# EAGLE design SparkFun_Air_Quality_ENS160 (EAGLE 9.6.2)
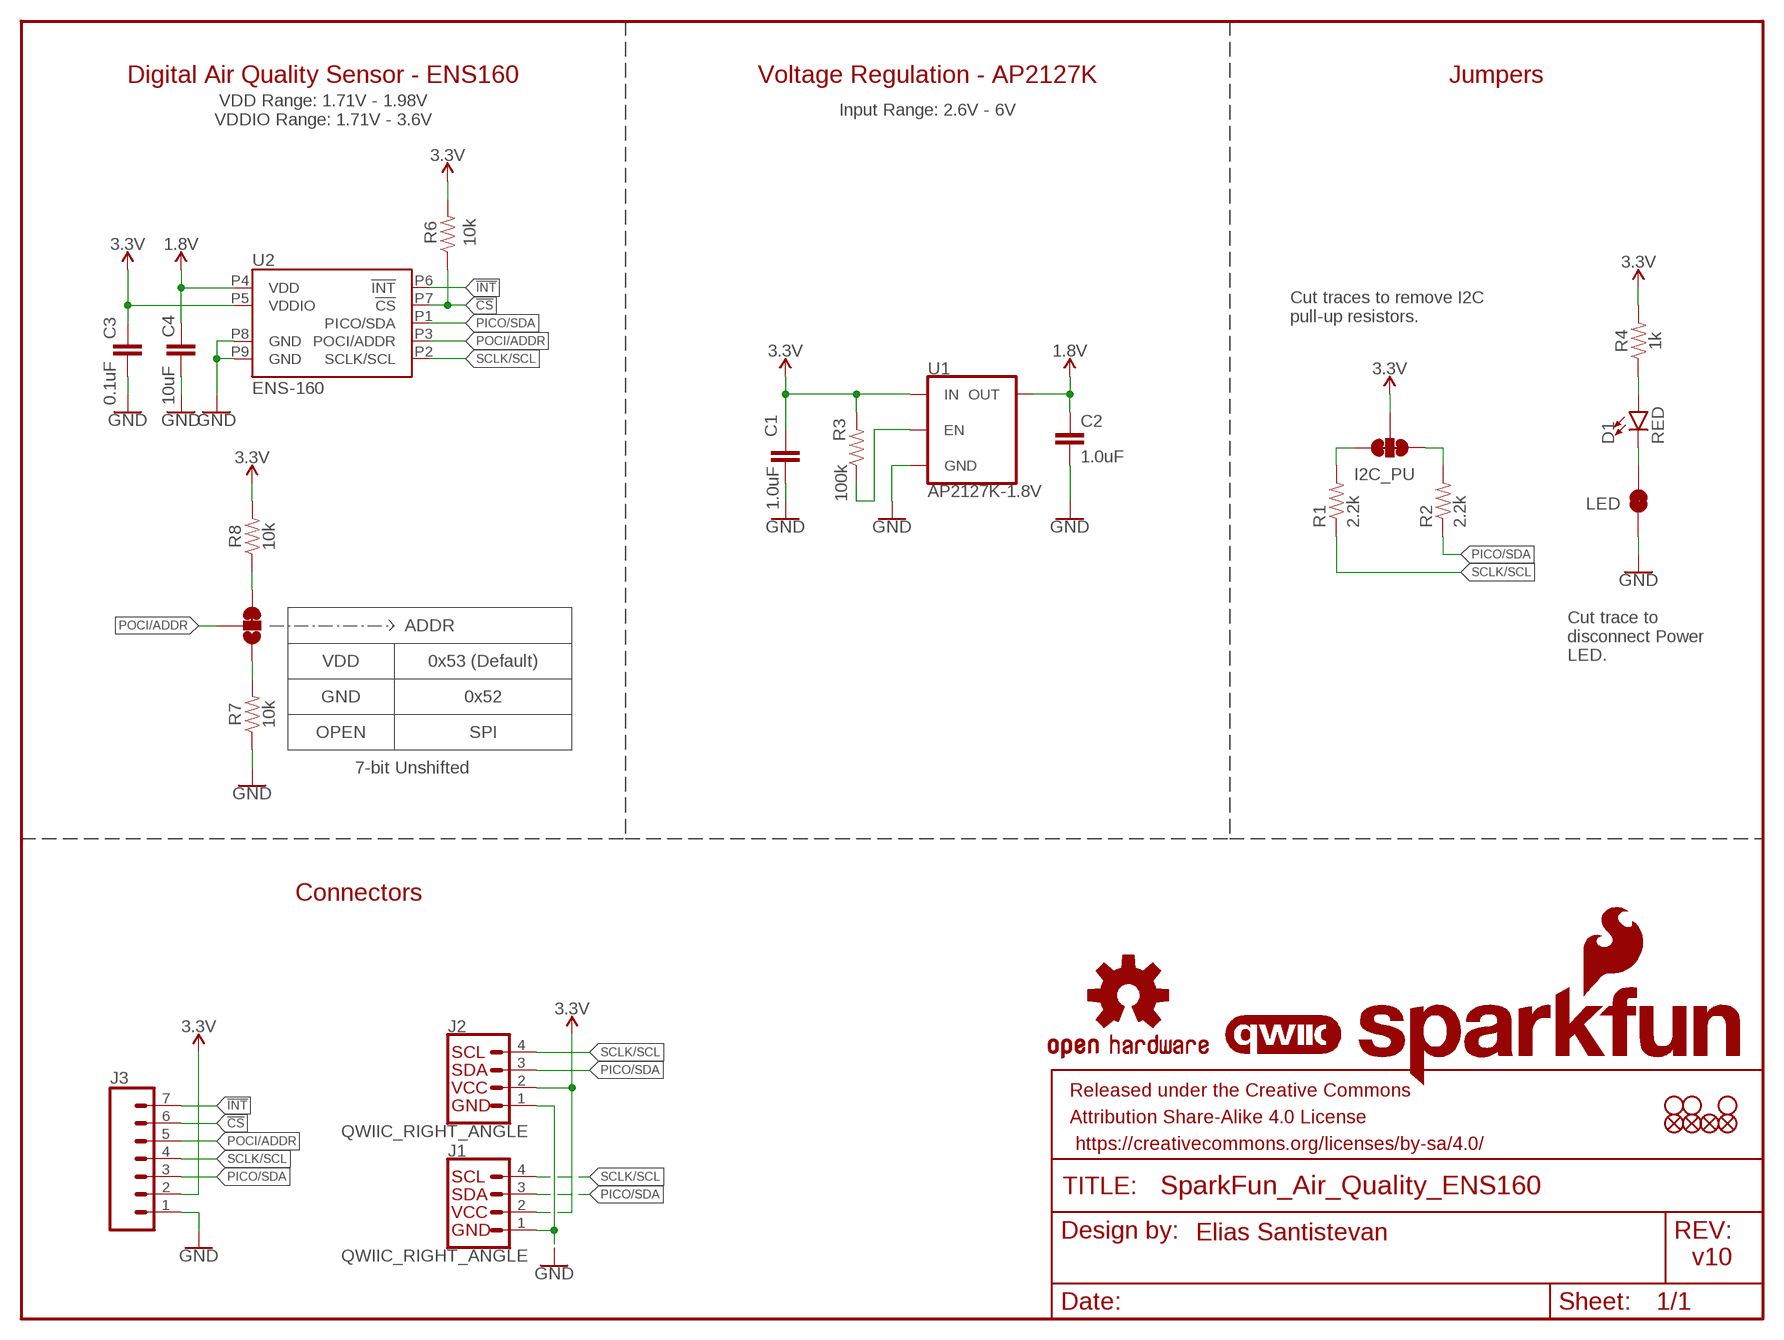
[diagram p0: schematic, sheet 1]

## Parts
ADDR  JUMPER-SMT_3_1-NC_TRACE_SILK  [SMT-JUMPER_3_1-NC_TRACE_SILK]
C1  1.0uF  1.0UF-0603-16V-10%  [0603]
C2  1.0uF  1.0UF-0603-16V-10%  [0603]
C3  0.1uF  0.1UF-0603-25V-(+80/-20%)  [0603]
C4  10uF  10UF-0603-6.3V-20%  [0603]
D1  RED  LED-RED0603  [LED-0603]
FD1  FIDUCIAL1X2  [FIDUCIAL-1X2]
FD2  FIDUCIAL1X2  [FIDUCIAL-1X2]
FD3  FIDUCIAL1X2  [FIDUCIAL-1X2]
FD4  FIDUCIAL1X2  [FIDUCIAL-1X2]
FRAME1  FRAME-LETTER  [CREATIVE_COMMONS]
I2C_PU  S_MODE  JUMPER-SMT_3_2-NC_TRACE_SILK  [SMT-JUMPER_3_2-NC_TRACE_SILK]
J1  QWIIC_RIGHT_ANGLE  QWIIC_CONNECTORJS-1MM  [JST04_1MM_RA]
J2  QWIIC_RIGHT_ANGLE  QWIIC_CONNECTORJS-1MM  [JST04_1MM_RA]
J3  CONN_07NO_SILK  [1X07_NO_SILK]
LED  JUMPER-SMT_2_NC_TRACE_SILK  [SMT-JUMPER_2_NC_TRACE_SILK]
LOGO2  OSHW-LOGOMINI  [OSHW-LOGO-MINI]
LOGO3  SFE_LOGO_NAME_FLAME.1_INCH  [SFE_LOGO_NAME_FLAME_.1]
LOGO4  QWIIC_LOGO_4MM  [QWIIC_4MM]
R1  2.2k  2.2KOHM-0603-1/10W-1%  [0603]
R2  2.2k  2.2KOHM-0603-1/10W-1%  [0603]
R3  100k  100KOHM-0603-1/10W-1%  [0603]
R4  1k  1KOHM-0603-1/10W-1%  [0603]
R6  10k  10KOHM-0603-1/10W-1%  [0603]
R7  10k  10KOHM-0603-1/10W-1%  [0603]
R8  10k  10KOHM-0603-1/10W-1%  [0603]
STANDOFF1  STAND-OFFTIGHT  [STAND-OFF-TIGHT]
STANDOFF2  STAND-OFFTIGHT  [STAND-OFF-TIGHT]
STANDOFF5  STAND-OFFTIGHT  [STAND-OFF-TIGHT]
U1  AP2127K-1.8V  V_REG_AP2127K-1.8V  [SOT23-5]
U2  ENS-160  [LGA-9]

## Nets
1.8V: C2.1 C4.1 U1.5(OUT) U2.P4(VDD)
3.3V: C1.1 C3.1 I2C_PU.2 J1.2 J2.2 J3.2 R3.2 R4.2 R6.2 R8.2 U1.1(IN) U2.P5(VDDIO)
!CS!: J3.6 R6.1 U2.P7(!CS!)
!INT!: J3.7 U2.P6(!INT!)
GND: C1.2 C2.2 C3.2 C4.2 J1.1 J2.1 J3.1 LED.1 R7.1 U1.2(GND) U2.P8(GND) U2.P9(GND)
N$1: R3.1 U1.3(EN)
N$2: D1.A R4.1
N$3: D1.C LED.2
N$4: ADDR.3 R8.1
N$5: I2C_PU.1 R1.2
N$6: I2C_PU.3 R2.2
N$7: ADDR.1 R7.2
PICO/SDA: J1.3 J2.3 J3.3 R2.1 U2.P1(PICO/SDA)
POCI/ADDR: ADDR.2 J3.5 U2.P3(POCI/ADDR)
SCLK/SCL: J1.4 J2.4 J3.4 R1.1 U2.P2(SCLK/SCL)

## Notes on the sheet
- Digital Air Quality Sensor - ENS160 | Voltage Regulation - AP2127K | Jumpers
- VDD Range: 1.71V - 1.98V
  VDDIO Range: 1.71V - 3.6V
- Input Range: 2.6V - 6V
- Cut traces to remove I2C
  pull-up resistors.
- VDD | 0x53 (Default)
- Cut trace to
  disconnect Power
  LED.
- GND | 0x52
- OPEN | SPI
- 7-bit Unshifted
- Connectors
- Elias Santistevan
- v10

## Library data of the parts
ADDR = SparkFun-Jumpers:JUMPER-SMT_3_1-NC_TRACE: Normally closed trace jumper (1 of 2 connections) This jumper has a trace between two pads so it's normally closed (NC). The other connection is normally open (NO). Use a razor knife to open the connection. For best results follow the IPC guidelines for cutting traces: Cutout at least 0.063 mm (0.005 in). Remove all loose material to clean up the cut area. Seal the cut with an approved epoxy. Reapply solder to reclose the connection, or to close the NO connection.
C1 C2 = SparkFun-Capacitors:1.0UF: 1µF ceramic capacitors A capacitor is a passive two-terminal electrical component used to store electrical energy temporarily in an electric field.; PROD_ID: CAP-00868
C3 = SparkFun-Capacitors:0.1UF: 0.1µF ceramic capacitors A capacitor is a passive two-terminal electrical component used to store electrical energy temporarily in an electric field.; PROD_ID: CAP-00810
C4 = SparkFun-Capacitors:10UF: 10.0µF ceramic capacitors A capacitor is a passive two-terminal electrical component used to store electrical energy temporarily in an electric field.; PROD_ID: CAP-11015
D1 = SparkFun-LED:LED-RED: Red SMD LED Used in manufacturing of most products at SparkFun Packages: 0603 - SMD 0603 package [Product Link] <http://docs.avagotech.com/docs/AV02-0551EN> 0603 SMART - SMD 0603 SMART package ( more efficient and expensive)[Product Link] <http://www.osram-os.com/Graphics/XPic2/00077099_0.pdf> 1206 - SMD1206 package [Product Link] <https://www.sparkfun.com/datasheets/DevTools/LilyPad/Q150OVS4.pdff> SparkFun Products: Pro Mini 328 -5V <https://www.sparkfun.com/products/821> RedBoard <https://www.sparkfun.com/products/12757> IOIO-OTG <https://www.sparkfun.com/products/13613>; PROD_ID: DIO-00819
FD1-FD4 = SparkFun-Aesthetics:FIDUCIAL: Fiducial Alignment Points Point-of-reference for pick-and-place machines and other optical instruments.
FRAME1 = SparkFun-Aesthetics:FRAME-LETTER: Schematic Frame - Letter Standard 8.5x11 US Letter frame; DESIGNER: Elias Santistevan
I2C_PU = SparkFun-Jumpers:JUMPER-SMT_3_2-NC_TRACE: Normally closed trace jumper (2 of 2 connections) This jumper has a trace between all three pads so they are normally closed (NC). Use a razor knife to open the connection(s). For best results follow the IPC guidelines for cutting traces: Cutout at least 0.063 mm (0.005 in). Remove all loose material to clean up the cut area. Seal the cut with an approved epoxy. Reapply solder to reclose the connection(s).
J1 J2 = SparkFun-Connectors:QWIIC_CONNECTOR: SparkFun I2C Standard Qwiic Connector An SMD 1mm pitch JST connector makes it easy and quick (get it? Qwiic?) to connect I2C devices to each other. The Qwiic system <http://www.sparkfun.com/qwiic> enables fast and solderless connection between popular platforms and various sensors and actuators. We carry 200mm <https://www.sparkfun.com/products/14204>, 100mm <https://www.sparkfun.com/products/14205>, 50mm <https://www.sparkfun.com/products/14206>, and breadboard friendly <https://www.sparkfun.com/products/14207> Qwiic cables. We also offer 10 pcs strips <https://www.sparkfun.com/products/14323> the SMD connectors.; PROD_ID: CONN-13694
J3 = SparkFun-Connectors:CONN_07: Multi connection point. Often used as Generic Header-pin footprint for 0.1 inch spaced/style header connections On any of the 0.1 inch spaced packages, you can populate with these: Break Away Headers - Straight <https://www.sparkfun.com/products/116> (PRT-00116) Break Away Male Headers - Right Angle <https://www.sparkfun.com/products/553> (PRT-00553) Female Headers <https://www.sparkfun.com/products/115> (PRT-00115) Break Away Headers - Machine Pin <https://www.sparkfun.com/products/117> (PRT-00117) Break Away Female Headers - Swiss Machine Pin <https://www.sparkfun.com/products/743> (PRT-00743) For SCREWTERMINALS and SPRING TERMINALS visit here: Screw Terimnals on SparkFun.com <https://www.sparkfun.com/search/results?term=Screw+Terminals> (5mm/3.5mm/2.54mm spacing) This device is also useful as a general connection point to wire up your design to another part of your project. Our various solder wires solder well into these plated through hole pads. Hook-Up Wire - Assortment (Stranded, 22 AWG) <https://www.sparkfun.com/products/11375> (PRT-11375) Hook-Up Wire - Assortment (Solid Core, 22 AWG) <https://www.sparkfun.com/products/11367> (PRT-11367) View the entire wire category on our website here <https://www.sparkfun.com/categories/141> Special notes: Molex polarized connector foot print use with SKU : PRT-08231 with associated crimp pins and housings. 1MM SMD Version SKU: PRT-10208 NOTES ON THE VARIANTS LOCK and LOCK_LONGPADS... This footprint was designed to help hold the alignment of a through-hole component (i.e. 6-pin header) while soldering it into place. You may notice that each hole has been shifted either up or down by 0.005 of an inch from it's more standard position (which is a perfectly straight line). This slight alteration caused the pins (the squares in the middle) to touch the edges of the holes. Because they are alternating, it causes a "brace" to hold the component in place. 0.005 has proven to be the perfect amount of "off-center" position when using our standard breakaway headers. Although looks a little odd when you look at the bare footprint, once you have a header in there, the alteration is very hard to notice. Also,if you push a header all the way into place, it is covered up entirely on the bottom side.
LED = SparkFun-Jumpers:JUMPER-SMT_2_NC_TRACE: Normally closed trace jumper This jumper has a trace between two pads so it's normally closed (NC). Use a razor knife to open the connection. For best results follow the IPC guidelines for cutting traces: Cutout at least 0.063 mm (0.005 in). Remove all loose material to clean up the cut area. Seal the cut with an approved epoxy. Reapply solder to reclose the connection.
LOGO2 = SparkFun-Aesthetics:OSHW-LOGO: Open-Source Hardware (OSHW) Logo This logo indicates the piece of hardware it is found on incorporates a OSHW license and/or adheres to the definition of open source hardware found here: http://freedomdefined.org/OSHW
LOGO3 = SparkFun-Aesthetics:SFE_LOGO_NAME_FLAME: SparkFun Font Logo w/ Flame This is the SparkFun full logo. The logo on the schematic will always be the same size; the package variant is the height of the flame part of the logo. Default layer for the logo on the board is tSilk.
LOGO4 = SparkFun-Aesthetics:QWIIC_LOGO: Qwiic Logos for placement on schematic and PCB. The 5.5mm silk logo is best for placing next to Qwiic connector.
R1 R2 = SparkFun-Resistors:2.2KOHM: 2.2kΩ resistor A resistor is a passive two-terminal electrical component that implements electrical resistance as a circuit element. Resistors act to reduce current flow, and, at the same time, act to lower voltage levels within circuits. - Wikipedia; PROD_ID: RES-08272
R3 = SparkFun-Resistors:100KOHM: 100kΩ resistor A resistor is a passive two-terminal electrical component that implements electrical resistance as a circuit element. Resistors act to reduce current flow, and, at the same time, act to lower voltage levels within circuits. - Wikipedia; PROD_ID: RES-07828
R4 = SparkFun-Resistors:1KOHM: 1kΩ resistor A resistor is a passive two-terminal electrical component that implements electrical resistance as a circuit element. Resistors act to reduce current flow, and, at the same time, act to lower voltage levels within circuits. - Wikipedia; PROD_ID: RES-07856
R6-R8 = SparkFun-Resistors:10KOHM: 10kΩ resistor A resistor is a passive two-terminal electrical component that implements electrical resistance as a circuit element. Resistors act to reduce current flow, and, at the same time, act to lower voltage levels within circuits. - Wikipedia; PROD_ID: RES-00824
STANDOFF1 STANDOFF2 STANDOFF5 = SparkFun-Hardware:STAND-OFF: Stand Off Drill holes for mechanically mounting via screws, standoffs, etc. Note: Use the keepout ring to avoid running the screw head into surrounding components. Variant Overviews STAND-OFF - Mechanical footprint for a #4 phillips button head screw. STAND-OFF-TIGHT - Mechanical footprint for a #4 phillips button head screw, Example SparkFun Products Screw - Phillips Head (1/4", 4-40, 10 pack) <https://www.sparkfun.com/products/10453> (PRT-10453) Screw - Phillips Head (1/2", 4-40, 10 pack) <https://www.sparkfun.com/products/10452> (PRT-10452) Screw - Phillips Head (3/4", 4-40, 10 pack) <https://www.sparkfun.com/products/10451> (PRT-10451) Screw - Phillips Head (1", 4-40, 10 pack) <https://www.sparkfun.com/products/10450> (PRT-10450)
U1 = SparkFun-IC-Power:V_REG_AP2127: AP2127 - 300mA CMOS LDO Regulator w/ Enable The AP2127 is CMOS process low dropout linear regulator with enable function, the regulator delivers a guaranteed 300mA (min.) continuous load current. Features Output Voltage Accuracy: ±1.5% Output Current: 300mA (Min.) Foldback Short Current Protection: 50mA Enable Function to Turn ON/OFF VOUT Low Dropout Voltage (3.3V): 250mV (Typ.) @IOUT=600mA Excellent Load Regulation: 0.2%/A (Typ.) Excellent Line Regulation: 0.02%/V (Typ.) Low Quiescent Current: 55μA (Typ.) Low Standby Current: 0.01μA (Typ.) Low Output Noise: 50μVRMS PSRR: 100Hz -65dB, 1kHz -65dB OTSD Protection Stable with 1.0μF Flexible Cap: Ceramic, Tantalum and Aluminum Electrolytic Operation Temperature Range: -40°C to 85°C ESD: MM 400V, HBM 4000V; PROD_ID: VREG-14239
U2 = ENS160:ENS-160: ScioSense Indoor Air Quality Sensor - ENS160 The ENS160 is a digital multi-gas sensor solution, based on metal oxide (MOX) technology with four sensor elements. The independent hotplate control allows the detection of a wide range of volatile organic compounds (VOCs) including ethanol, toluene, hydrogen and oxidizing gases with superior sensitivity. The ENS160 supports intelligent algorithms to process raw sensor measurements on-chip. These algorithms calculate CO2-equivalents, TVOC, air quality indices (AQIs) and perform humidity and temperature compensation, as well as baseline management, all on chip.; PROD_ID: IC-17100

## Board
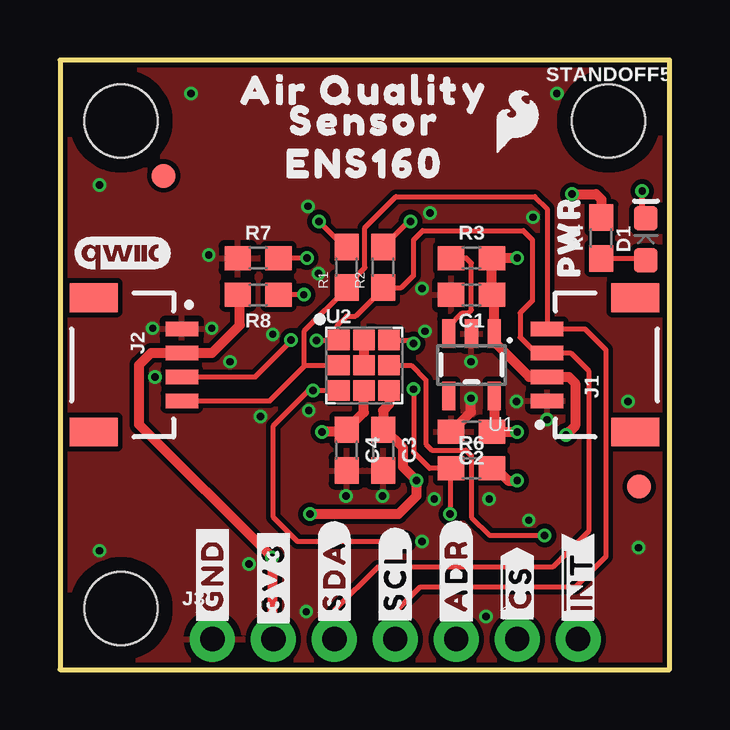
[diagram p1: board, top side]
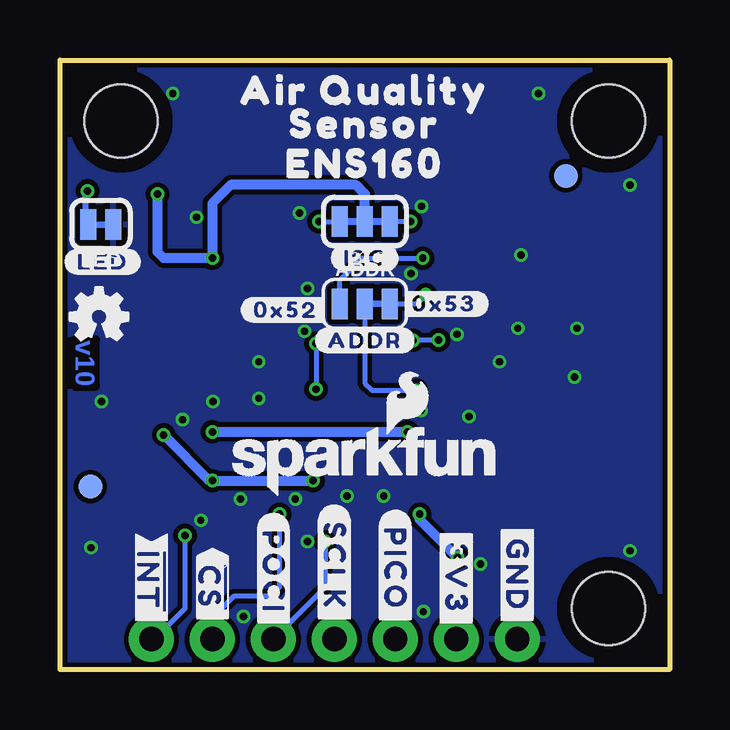
[diagram p2: board, bottom side, seen from below]

Size 25.4 x 25.4 mm. Coordinates in mm from the lower left corner, seen from the top.
Outline: 25.4,25.4 0,25.4 0,0 25.4,0 25.4,25.4
Copper layers (1*16): Top 0.035mm / dielectric 1.5mm / Bottom 0.035mm
Design rules "SparkFun-2-Layer-Minimum-JLCPCB": minimum track width 5mil, minimum drill 0.3mm, track to track 5mil, track to pad 5mil, pad to pad 5mil, via to via 5mil, smd to smd 5mil, copper to edge 7mil, drill to drill 7mil, minimum pad ring 5mil, minimum via ring 5mil, stop-mask expansion 2.5mil, vias tented up to drill 25mil, thermal gap 10mil

### Footprints (pad centres in the part's own frame; a part is rotated, then mirrored left to right if it is on the bottom)
SMT-JUMPER_3_1-NC_TRACE_SILK = smd 0.66 x 1.27: 1 -1.041,0; 2 0,0; 3 1.041,0
0603 = smd 1.1 x 1: 1 -0.85,0; 2 0.85,0
LED-0603 = smd 1 x 1: A -0.877,0; C 0.877,0
FIDUCIAL-1X2 = smd 1 x 1: 1 0,0
SMT-JUMPER_3_2-NC_TRACE_SILK = smd 0.66 x 1.27: 1 -1.041,0; 2 0,0; 3 1.041,0
JST04_1MM_RA = smd 0.6 x 1.35: 1 -1.5,0; 2 -0.5,0; 3 0.5,0; 4 1.5,0 | smd 1.2 x 2: NC1 2.8,-3.675; NC2 -2.8,-3.675
1X07_NO_SILK = drill 1.016 pad 1.88: 1 0,0; 2 2.54,0; 3 5.08,0; 4 7.62,0; 5 10.16,0; 6 12.7,0; 7 15.24,0
SMT-JUMPER_2_NC_TRACE_SILK = smd 0.66 x 1.27: 1 -0.521,0; 2 0.521,0
STAND-OFF-TIGHT = hole 3.048: 0,0
SOT23-5 = smd 0.55 x 1.2: 1 -0.95,-1.3; 2 0,-1.3; 3 0.95,-1.3; 4 0.95,1.3; 5 -0.95,1.3
LGA-9 = smd 0.9 x 0.85: P1 -1.085,1.03; P2 -1.085,-0.02; P3 -1.085,-1.07; P4 -0.035,-1.07; P5 1.015,-1.07; P6 1.015,-0.02; P7 1.015,1.03; P8 -0.035,1.03; P9 -0.035,-0.02

### Placement (x,y rotation side)
ADDR  12.7,15.24 0 bottom
C1  17.14,15.62 180 top
C2  17.14,9.91 180 top
C3  13.46,9.14 270 top
C4  11.94,9.14 270 top
D1  24.41,17.93 90 top
FD1  4.32,20.57 0 bottom
FD2  24.13,7.62 0 bottom
FD3  4.32,20.57 0 top
FD4  24.13,7.62 0 top
FRAME1  -19.05,-16.51 0 top  (outside the outline)
I2C_PU  12.7,18.67 180 bottom
J1  20.29,12.7 90 top
J2  5.08,12.7 270 top
J3  6.35,1.27 0 top
LED  23.7,18.54 180 bottom
LOGO2  23.77,14.71 0 bottom
LOGO3  12.66,8.71 0 bottom
LOGO4  2.62,17.35 0 top
R1  11.94,16.76 90 top
R2  13.46,16.76 90 top
R3  10k  [0603]  17.14,17.14 0 top
R4  22.56,17.98 90 top
R6  17.14,8.38 0 top
R7  8.26,17.14 0 top
R8  8.26,15.62 180 top
STANDOFF1  2.54,22.86 0 top
STANDOFF2  2.54,2.54 0 top
STANDOFF5  22.86,22.86 0 top
U1  17.14,12.7 180 top
U2  12.7,12.7 0 top
U$1  [#GND#3]  6.35,3.94 90 top
U$2  [#3V3#4]  8.89,3.81 90 top
U$3  [#SDA#5]  11.43,3.94 90 top
U$4  [#SCL#4]  13.97,3.81 90 top
U$5  [ENS16016]  12.7,21.08 0 bottom
U$6  [#ADDR#6]  12.7,13.72 0 bottom
U$7  [#SCLK#16021]  13.97,4.32 270 bottom
U$8  [#ADR#441018]  16.51,3.94 90 top
U$9  [#GND#3]  6.35,3.94 270 bottom
U$10  [#3V3#4]  8.89,3.81 270 bottom
U$11  [##INT##9]  21.59,3.68 270 bottom
U$12  [AIR_QUALITY441014]  12.7,24.13 0 bottom
U$13  [SENSOR441015]  12.7,22.73 0 bottom
U$14  [#0X53#16019]  9.4,15.24 0 bottom
U$15  [#0X52#16019]  16,14.99 0 bottom
U$16  [#LED#11]  23.62,16.99 0 bottom
U$17  [AIR_QUALITY441014]  12.7,24.13 0 top
U$18  [##INT##6]  21.59,3.68 90 top
U$19  [SENSOR441015]  12.7,22.86 0 top
U$20  [SFE_LOGO_FLAME_.1]  19.05,22.86 0 top
U$21  [PWR9]  21.21,18.03 90 top
U$22  [##CS##16019]  19.05,3.43 270 bottom
U$23  [#POCI#16020]  16.51,4.06 270 bottom
U$24  [#PICO#16021]  11.43,4.19 270 bottom
U$25  [#I2C#11]  12.7,17.14 0 bottom
U$27  [##CS##441016]  19.05,3.43 90 top
U$28  [ENS16016]  12.7,21.08 0 top

### Tracks (layer width: path | path; a pad name or v marks a point on that pad's centre or on a via)
1.8V  (via drill 0.3)
  Top 0.406: v10.92,9.91 11.85,9.91 C4.1 12.66,10.72 U2.P4 | U1.5 18.09,10.01 C2.1 v19.05,9.91
  Bottom 0.406: v19.05,9.91 v10.92,9.91
3.3V  (via drill 0.3)
  Top 0.406: U2.P5 13.71,11.05 13.46,10.79 C3.1 13.53,9.99 14.29,9.23 14.29,8.44 v14.86,7.87 14.86,7.24 14.1,6.48 v10.41,6.48 | v21.08,9.78 21.46,10.16 21.46,11.94 21.2,12.2 J1.2 19.55,12.2 18.09,13.65 U1.1 18.09,15.52 C1.1 R3.2 v19.05,17.14 | J3.2 8.84,1.32 v8.84,4.67 3.3,10.21 3.3,12.7 3.8,13.2 J2.2 6.34,13.2 7.49,14.35 7.49,15.53 R8.2 | v21.34,19.81 22.34,19.81 22.55,19.59 R4.2 | R6.2 18.16,8.38 18.67,7.87 v19.05,7.87
  Bottom 0.406: v21.08,9.78 19.18,7.87 v19.05,7.87 v14.86,7.87 | v10.41,6.48 10.41,6.25 v8.84,4.67 | v21.34,19.81 21.34,17.4 21.08,17.14 v19.05,17.14 19.05,19.43 18.29,20.19 13.08,20.19 12.7,19.81 I2C_PU.2
!CS!  (via drill 0.3)
  Top 0.203: v14.73,11.68 14.73,9.06 15.41,8.38 R6.1 16.26,8.34 v16.26,6.48 | U2.P7 14.59,13.73 v14.73,13.59
  Bottom 0.203: v14.73,13.59 v14.73,11.68 | v16.26,6.48 16.26,3.43 16.64,3.05 18.16,3.05 19.05,2.16 J3.6
!INT!  (via drill 0.3)
  Top 0.203: U2.P6 14.62,12.68 15.24,12.06 15.24,9.4 15.49,9.14 16.91,9.14 17.14,8.9 17.14,6.35 17.91,5.59 v20.19,5.59
  Bottom 0.203: J3.7 21.46,1.27 20.19,2.54 v20.19,5.59
GND  (via drill 0.3)
  Top 0.406: C2.2 17.12,10.73 v17.12,11.3 | U2.P8 U2.P9
  other vias: 6.32,14.22 3.86,14.22 20.7,24 5.46,24 1.65,20.19 1.65,4.95 17.12,12.83 15.09,15.88 20.29,10.41 19.02,11.18 11.91,7.24 13.44,7.24 19.53,6.22 8.86,13.97 15.21,14.1 24.1,5.08 10.26,2.41 7.87,4.39 3.96,12.19 8.36,10.54 10.36,10.79 15.09,5.33 6.2,17.27 10.77,16.51 10.34,19.3 15.42,19.02 7.09,12.83 19.71,18.85 17.75,2.21 23.67,11.18 17.88,7.11 15.6,7.11
  pour Top (isolate 0.203, rank 2): 25.4,0 25.4,25.4 0,25.4 0,0
  pour Bottom (isolate 0.203, rank 2): 0,0 0,25.4 25.4,25.4 25.4,0
N$1
  Top 0.203: U1.3 16.2,14.29 16.76,14.86 17.02,14.86 17.14,14.98 17.14,16.93 16.93,17.14 R3.1
N$2
  Top 0.203: R4.1 24.33,17.13
  Top 0.254: 24.33,17.13 D1.A
N$3  (via drill 0.3)
  Top 0.254: D1.C 24.26,18.96 v24.26,19.94
  Bottom 0.254: v24.26,19.94 24.35,19.85 24.35,18.67 LED.2
N$4  (via drill 0.3)
  Top 0.203: v10.16,15.62 R8.1
  Bottom 0.203: ADDR.3 10.54,15.24 v10.16,15.62
N$5  (via drill 0.3)
  Top 0.203: R1.2 11.85,17.61 v10.79,18.67
  Bottom 0.203: v10.79,18.67 I2C_PU.1
N$6  (via drill 0.3)
  Top 0.203: R2.2 14.52,18.67 v14.61,18.67
  Bottom 0.203: v14.61,18.67 I2C_PU.3
N$7  (via drill 0.3)
  Top 0.203: v10.29,17.14 R7.2
  Bottom 0.203: ADDR.1 13.74,16.23 12.83,17.14 v10.29,17.14
PICO/SDA  (via drill 0.3)
  Top 0.203: J2.3 8.14,12.2 9.67,13.73 v9.63,13.73 | v10.69,13.72 10.71,13.73 U2.P1 11.56,13.79 11.56,14.35 11.94,14.73 12.32,14.73 13.46,15.88 R2.1 14.22,15.91 14.73,16.42 14.73,17.91 15.11,18.29 19.3,18.29 19.68,17.91 19.68,15.37 19.18,14.86 19.18,13.84 19.82,13.2 J1.3 21.28,13.2 22.03,12.45 22.03,5.77 20.52,4.27 13.23,4.27 11.43,2.46 J3.3
  Bottom 0.203: v9.63,13.73 10.68,13.73 v10.69,13.72
POCI/ADDR  (via drill 0.3)
  Top 0.203: v14.35,5.33 9.91,5.33 8.89,6.35 8.89,10.16 10.36,11.63 v10.54,11.63 U2.P3
  Bottom 0.203: v14.35,5.33 14.35,3.43 J3.5 | ADDR.2 12.7,11.94 12.39,11.63 v10.54,11.63
SCLK/SCL
  Top 0.203: J2.4 8.75,11.2 10.23,12.68 | 10.23,12.68 10.16,12.68 10.16,14.1 11.94,15.88 R1.1 11.94,15.99 12.7,16.75 12.7,18.41 13.99,19.71 19.79,19.71 20.3,19.2 J1.4 21.87,14.2 22.74,13.33 22.74,4.71 21.46,3.43 14.99,3.43 13.97,2.41 J3.4 | 10.23,12.68 U2.P2

### Text on the board
Bottom: v10
Measures: Units in Inches